# Altium project JacdacBreadboardBc30Mount 134.PrjPCB
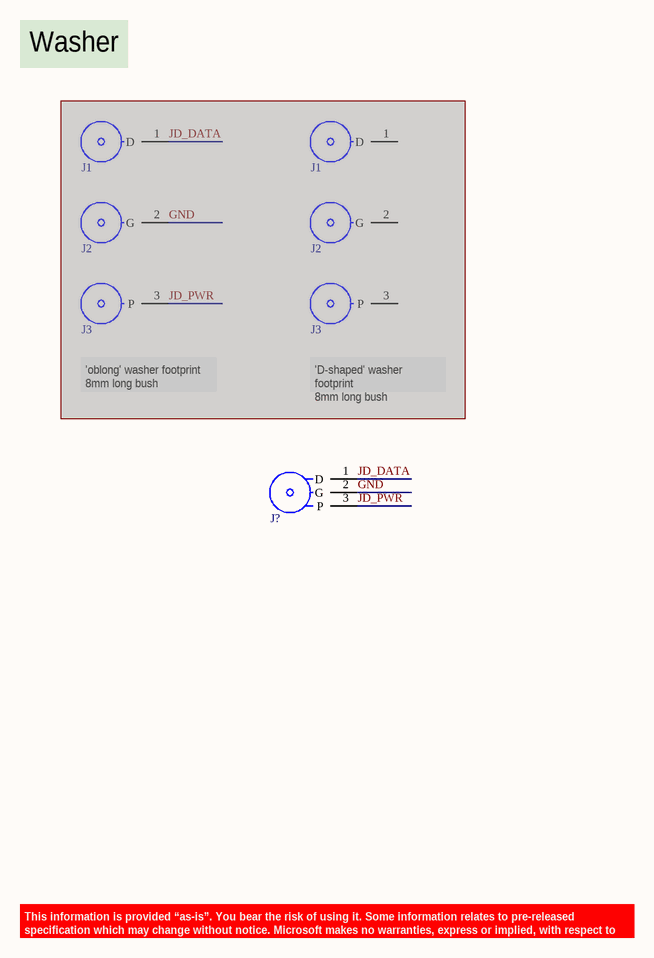
[diagram p0: JacdacBreadboardBc30Mount 134.SchDoc]
ProjectRevision: 0.3; ProjectLicenceTerms: Attribution 4.0 International (CC BY 4.0); ProjectDrawnBy: S. Hodges; ProjectCodenameID: 134; ProjectCodenameDescription: Interface board for mounting BC30 Jacdac modules; ProjectCodeName: JacdacBreadboardBc30Mount
1 sheet, 7 parts. Net scope: global (net labels, ports and power ports of the same name join across sheets).
Board files: JacdacBreadboardBc30Mount 134.PcbDoc, JacdacBreadboardBc30Mount 134 flex-hack.PcbDoc, JacdacBreadboardBc30Mount 134 single.PcbDoc, JacdacBreadboardBc30Mount 134 panel.PcbDoc, JacdacBreadboardBc30Mount 134 flex-hack-panel.PcbDoc

## Sheet JacdacBreadboardBc30Mount 134.SchDoc: Complete design
size A4; DrawnBy: S. Hodges; DocumentNumber: 1; Revision: 0.3; SheetNumber: 1; SheetTotal: 1; VersionControl_RevNumber: 1

### Parts
(Parts that share a designator on the sheet are numbered #1, #2 ... from top to bottom, then left to right.)
J1#1  Jacdac breadboard washer JD_DATA  [Jacdac_breadboard_transition_hole_rings_pin1_v5-PTH-OBLONG]  (value not drawn)  (masked out: inside a compile mask, not in the netlist)
J1#2  Jacdac breadboard washer JD_DATA  [Jacdac_breadboard_transition_hole_rings_pin1_v5-PTH]  (value not drawn)  (masked out: inside a compile mask, not in the netlist)
J2#1  Jacdac breadboard washer GND  [Jacdac_breadboard_transition_hole_rings_pin2_v5-JLC-OBLONG]  (value not drawn)  (masked out: inside a compile mask, not in the netlist)
J2#2  Jacdac breadboard washer GND  [Jacdac_breadboard_transition_hole_rings_pin2_v5-JLC]  (value not drawn)  (masked out: inside a compile mask, not in the netlist)
J3#1  Jacdac breadboard washer JD_PWR  [Jacdac_breadboard_transition_hole_rings_pin3_v5-JLC-OBLONG]  (value not drawn)  (masked out: inside a compile mask, not in the netlist)
J3#2  Jacdac breadboard washer JD_PWR  [Jacdac_breadboard_transition_hole_rings_pin3_v5-JLC]  (value not drawn)  (masked out: inside a compile mask, not in the netlist)
J?  Jacdac breadboard double washer all signals  [Jacdac_breadboard_transition_hole_rings_BC30]  (value not drawn)

### Nets
GND: J?.2(G)
JD_DATA: J?.1(D)
JD_PWR: J?.3(P)

### Notes on the sheet
- Washer
- 'oblong' washer footprint
  8mm long bush
- 'D-shaped' washer footprint
  8mm long bush
- This information is provided “as-is”. You bear the risk of using it. Some information relates to pre-released specification which may change without notice. Microsoft makes no warranties, express or implied, with respect to the information provided here.
- PROJECT FILENAME
- PROJECT CODENAME
- Microsoft
- PROJECT DESCRIPTION
- SHEET DESCRIPTION
- SHEET FILENAME
- LICENCE
- LAST MODIFIED
- PAGE
- OF
- DRAWN BY
- REVISION
- PCB ID

### Library data of the parts
J1#1 J1#2 = Jacdac breadboard washer JD_DATA: Manufacturer Part Number 1: SMTSM3080; Manufacturer 1: Sinhoo; Hole Size: M3; Hole Clearance: 7.0mm; Supplier 1: LCSC; Supplier Part Number 1: C2916369; ComponentLink1Description: Online datasheet; ComponentLink1URL: https://datasheet.lcsc.com/lcsc/2111221830_Sinhoo-SMTSO3080CTJ_C2916369.pdf
J2#1 J2#2 = Jacdac breadboard washer GND: Manufacturer 1: Sinhoo; Manufacturer Part Number 1: SMTSO3080; Hole Size: M3; Hole Clearance: 7.0mm; Supplier 1: LCSC; Supplier Part Number 1: C2916369; ComponentLink1Description: Online datasheet; ComponentLink1URL: https://datasheet.lcsc.com/lcsc/2111221830_Sinhoo-SMTSO3080CTJ_C2916369.pdf
J3#1 J3#2 = Jacdac breadboard washer JD_PWR: Manufacturer Part Number 1: SMTSO3080; Manufacturer 1: Sinhoo; Hole Size: M3; Hole Clearance: 7.0mm; Supplier Part Number 1: C2916369; Supplier 1: LCSC; ComponentLink1Description: Online datasheet; ComponentLink1URL: https://datasheet.lcsc.com/lcsc/2111221830_Sinhoo-SMTSO3080CTJ_C2916369.pdf
J? = Jacdac breadboard double washer all signals: Hole Size: M3; Hole Clearance: 7.0mm